# EAGLE design mbed-WiFi-Cloud-v1.0.0 (EAGLE 7.7.0)

## Sheet 1 of 4
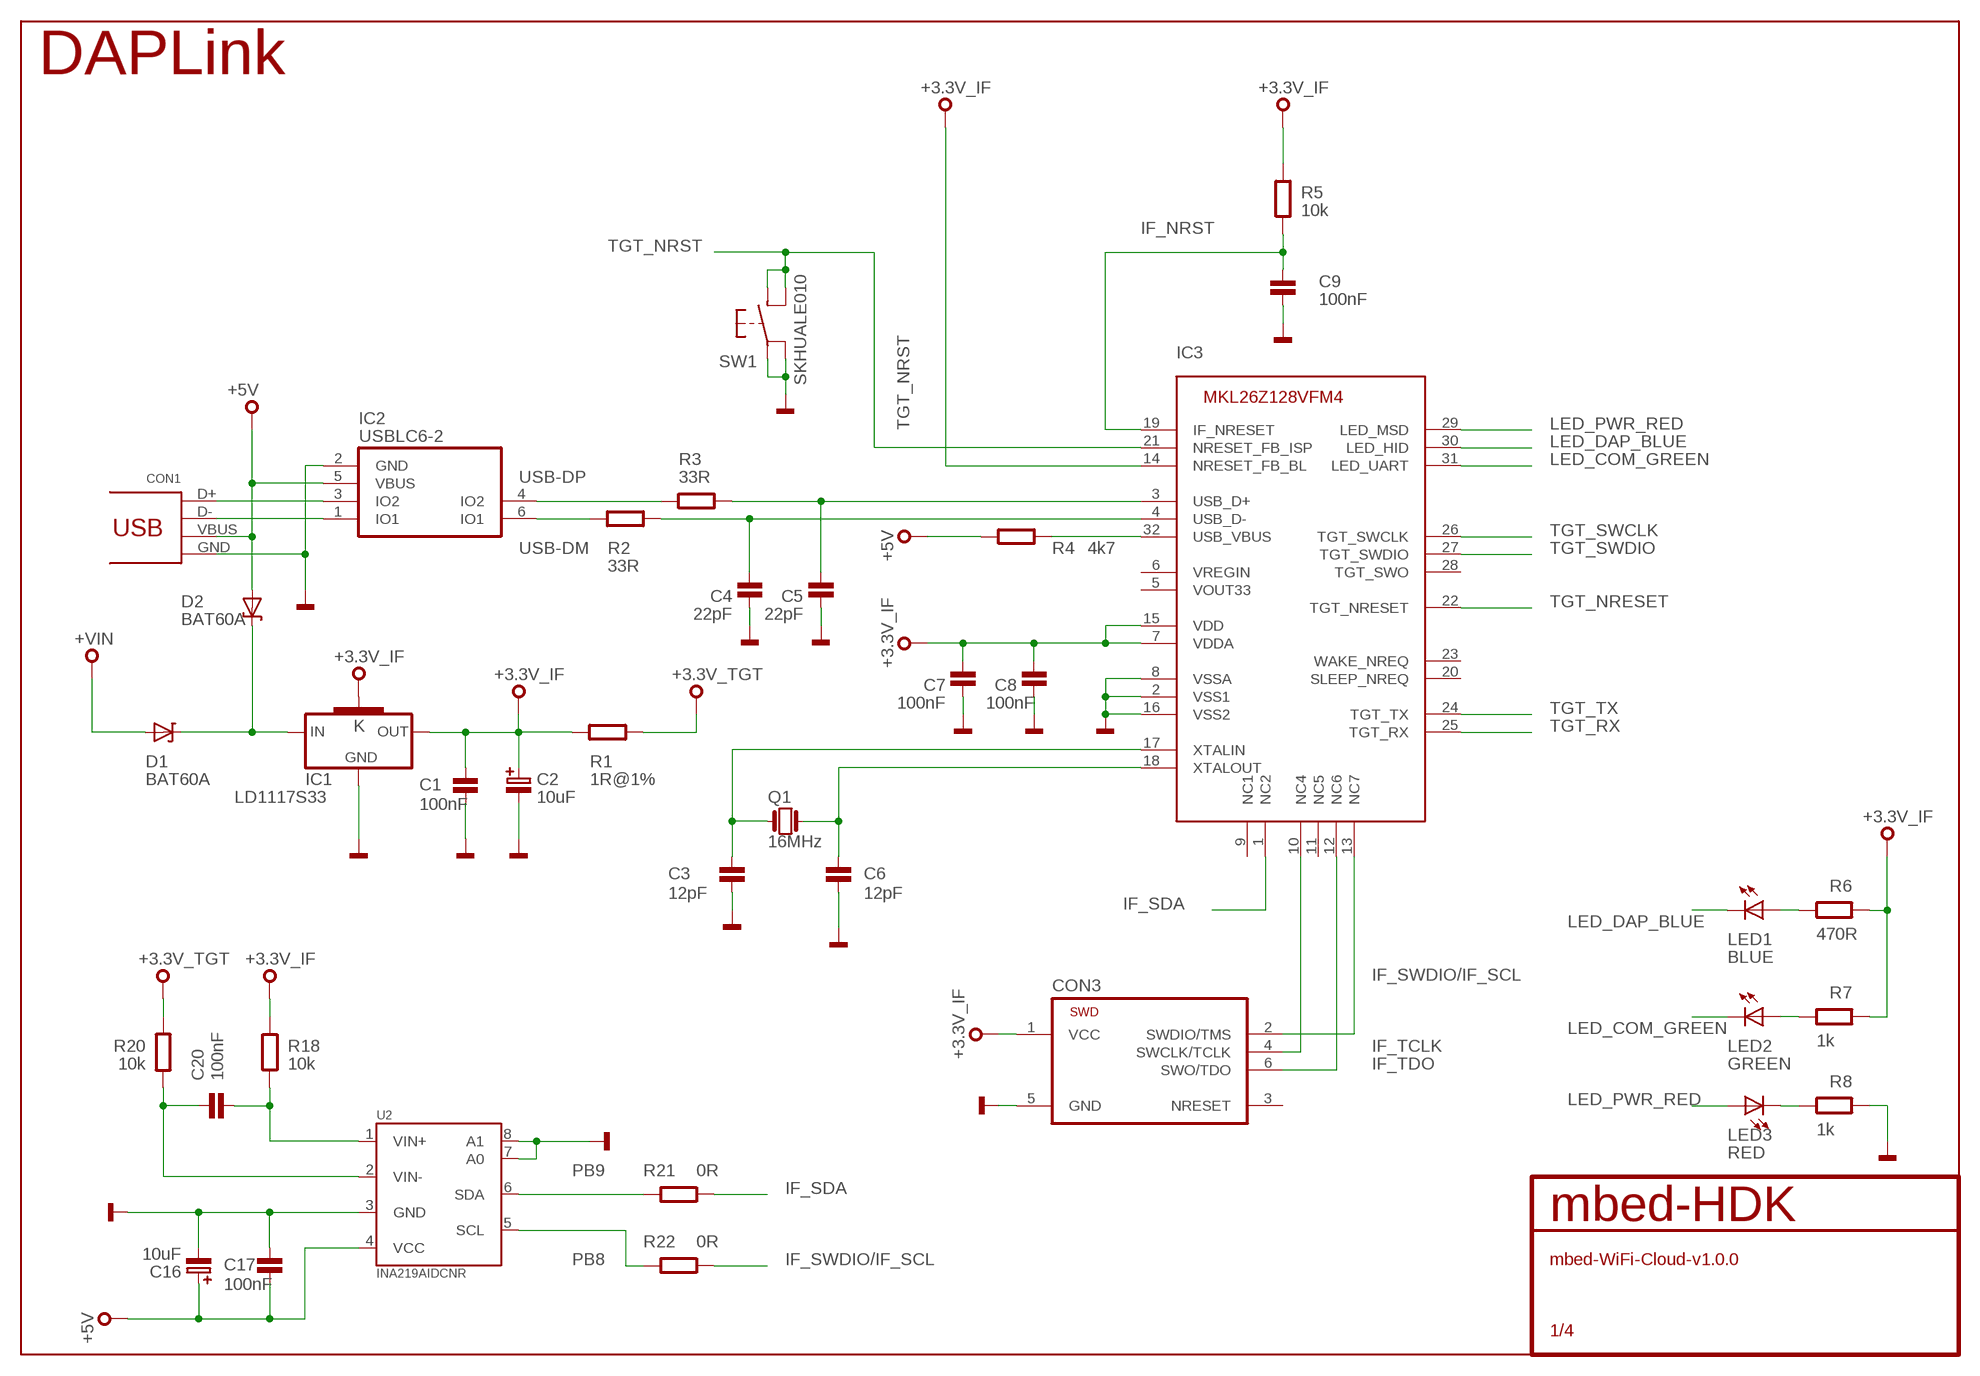
[diagram p0: schematic, sheet 1]

### Parts
C1  100nF  C0603  [0603]
C2  10uF  C-POL_B  [CASE-B]
C3  12pF  C0603  [0603]
C4  22pF  C0603  [0603]
C5  22pF  C0603  [0603]
C6  12pF  C0603  [0603]
C7  100nF  C0603  [0603]
C8  100nF  C0603  [0603]
C9  100nF  C0603  [0603]
C16  10uF  C-POL_B  [CASE-B]
C17  100nF  C0603  [0603]
C20  100nF  C0603  [0603]
CON1  USB_MICROB  [MOLEX-47364-0001]
CON3  TC2030-CTX-NL  [TC2030-CTX-NL]
D1  BAT60A  [SOD323]
D2  BAT60A  [SOD323]
IC1  LD1117S33  [SOT223]
IC2  USBLC6-2SC6  [SOT23-6L]
IC3  IF_MKL26Z128VFM4  [HVQFN32]
LED1  BLUE  LED0603  [CHIPLED_0603]
LED2  GREEN  LED0603  [CHIPLED_0603]
LED3  RED  LED0603  [CHIPLED_0603]
Q1  16MHz  Q_2.5X2.0  [2.5X2.0]
R1  1R@1%  R0603  [0603@1]
R2  33R  R0603  [0603@1]
R3  33R  R0603  [0603@1]
R4  4k7  R0603  [0603@1]
R5  10k  R0603  [0603@1]
R6  470R  R0603  [0603@1]
R7  1k  R0603  [0603@1]
R8  1k  R0603  [0603@1]
R18  10k  R0603  [0603@1]
R20  10k  R0603  [0603@1]
R21  0R  R0603  [0603@1]
R22  0R  R0603  [0603@1]
SW1  SKHUALE010  [SKHUALE010]
U2  INA219AIDCNR  [SOT23-8]

### Nets
+3.3V_IF: C1.1 C2.1 C7.2 C8.2 CON3.1(VCC) IC1.2(OUT) IC1.4(K) IC3.7(VDDA) IC3.14(NRESET_FB_BL) IC3.15(VDD) R1.2 R5.2 R6.1 R7.1 R18.2
+3.3V_TGT: R1.1 R20.2 ; also sheet 2,3,4
+5V: C16.1 C17.2 CON1.VBUS D2.A IC2.5(VBUS) R4.1 U2.4(VCC) ; also sheet 3
+VIN: D1.A ; also sheet 3
DM: CON1.D- IC2.1(IO1)
DP: CON1.D+ IC2.3(IO2)
GND: C1.2 C2.2 C3.1 C4.1 C5.1 C6.1 C7.1 C8.1 C9.1 C16.2 C17.1 CON1.GND CON3.5(GND) IC1.1(GND) IC2.2(GND) IC3.2(VSS1) IC3.8(VSSA) IC3.16(VSS2) R8.1 SW1.P$1(A1) SW1.P$2(A2) U2.3(GND) U2.7(A0) U2.8(A1) ; also sheet 2,3,4
IF_NRST: C9.2 IC3.19(IF_NRESET) R5.1
IF_SDA: IC3.1(NC2) R21.1
IF_SWDIO/IF_SCL: CON3.2(SWDIO/TMS) IC3.13(NC7) R22.1
IF_TCLK: CON3.4(SWCLK/TCLK) IC3.10(NC4)
IF_TDO: CON3.6(SWO/TDO) IC3.12(NC6)
LED_COM_GREEN: IC3.31(LED_UART) LED2.C
LED_DAP_BLUE: IC3.30(LED_HID) LED1.C
LED_PWR_RED: IC3.29(LED_MSD) LED3.A
N$1: IC3.32(USB_VBUS) R4.2
N$6: LED2.A R7.2
N$7: C4.2 IC3.4(USB_D-) R2.1
N$8: C3.2 IC3.17(XTALIN) Q1.1
N$10: D1.K D2.K IC1.3(IN)
N$12: C6.2 IC3.18(XTALOUT) Q1.3
N$13: LED1.A R6.2
N$15: C20.2 R20.1 U2.2(VIN-)
N$16: C5.2 IC3.3(USB_D+) R3.1
N$17: C20.1 R18.1 U2.1(VIN+)
N$33: LED3.C R8.2
PB8: R22.2 U2.5(SCL) ; also sheet 2,3
PB9: R21.2 U2.6(SDA) ; also sheet 2,3
TGT_NRESET: IC3.22(TGT_NRESET) ; also sheet 2,3
TGT_NRST: IC3.21(NRESET_FB_ISP) SW1.P$3(B1) SW1.P$4(B2)
TGT_RX: IC3.25(TGT_RX) ; also sheet 2
TGT_SWCLK: IC3.26(TGT_SWCLK) ; also sheet 2
TGT_SWDIO: IC3.27(TGT_SWDIO) ; also sheet 2
TGT_TX: IC3.24(TGT_TX) ; also sheet 2
USB-DM: IC2.6(IO1) R2.2
USB-DP: IC2.4(IO2) R3.2
Unconnected: CON3.3(NRESET) IC3.5(VOUT33) IC3.6(VREGIN) IC3.9(NC1) IC3.11(NC5) IC3.20(SLEEP_NREQ) IC3.23(WAKE_NREQ) IC3.28(TGT_SWO)

### Notes on the sheet
- DAPLink

## Sheet 2 of 4
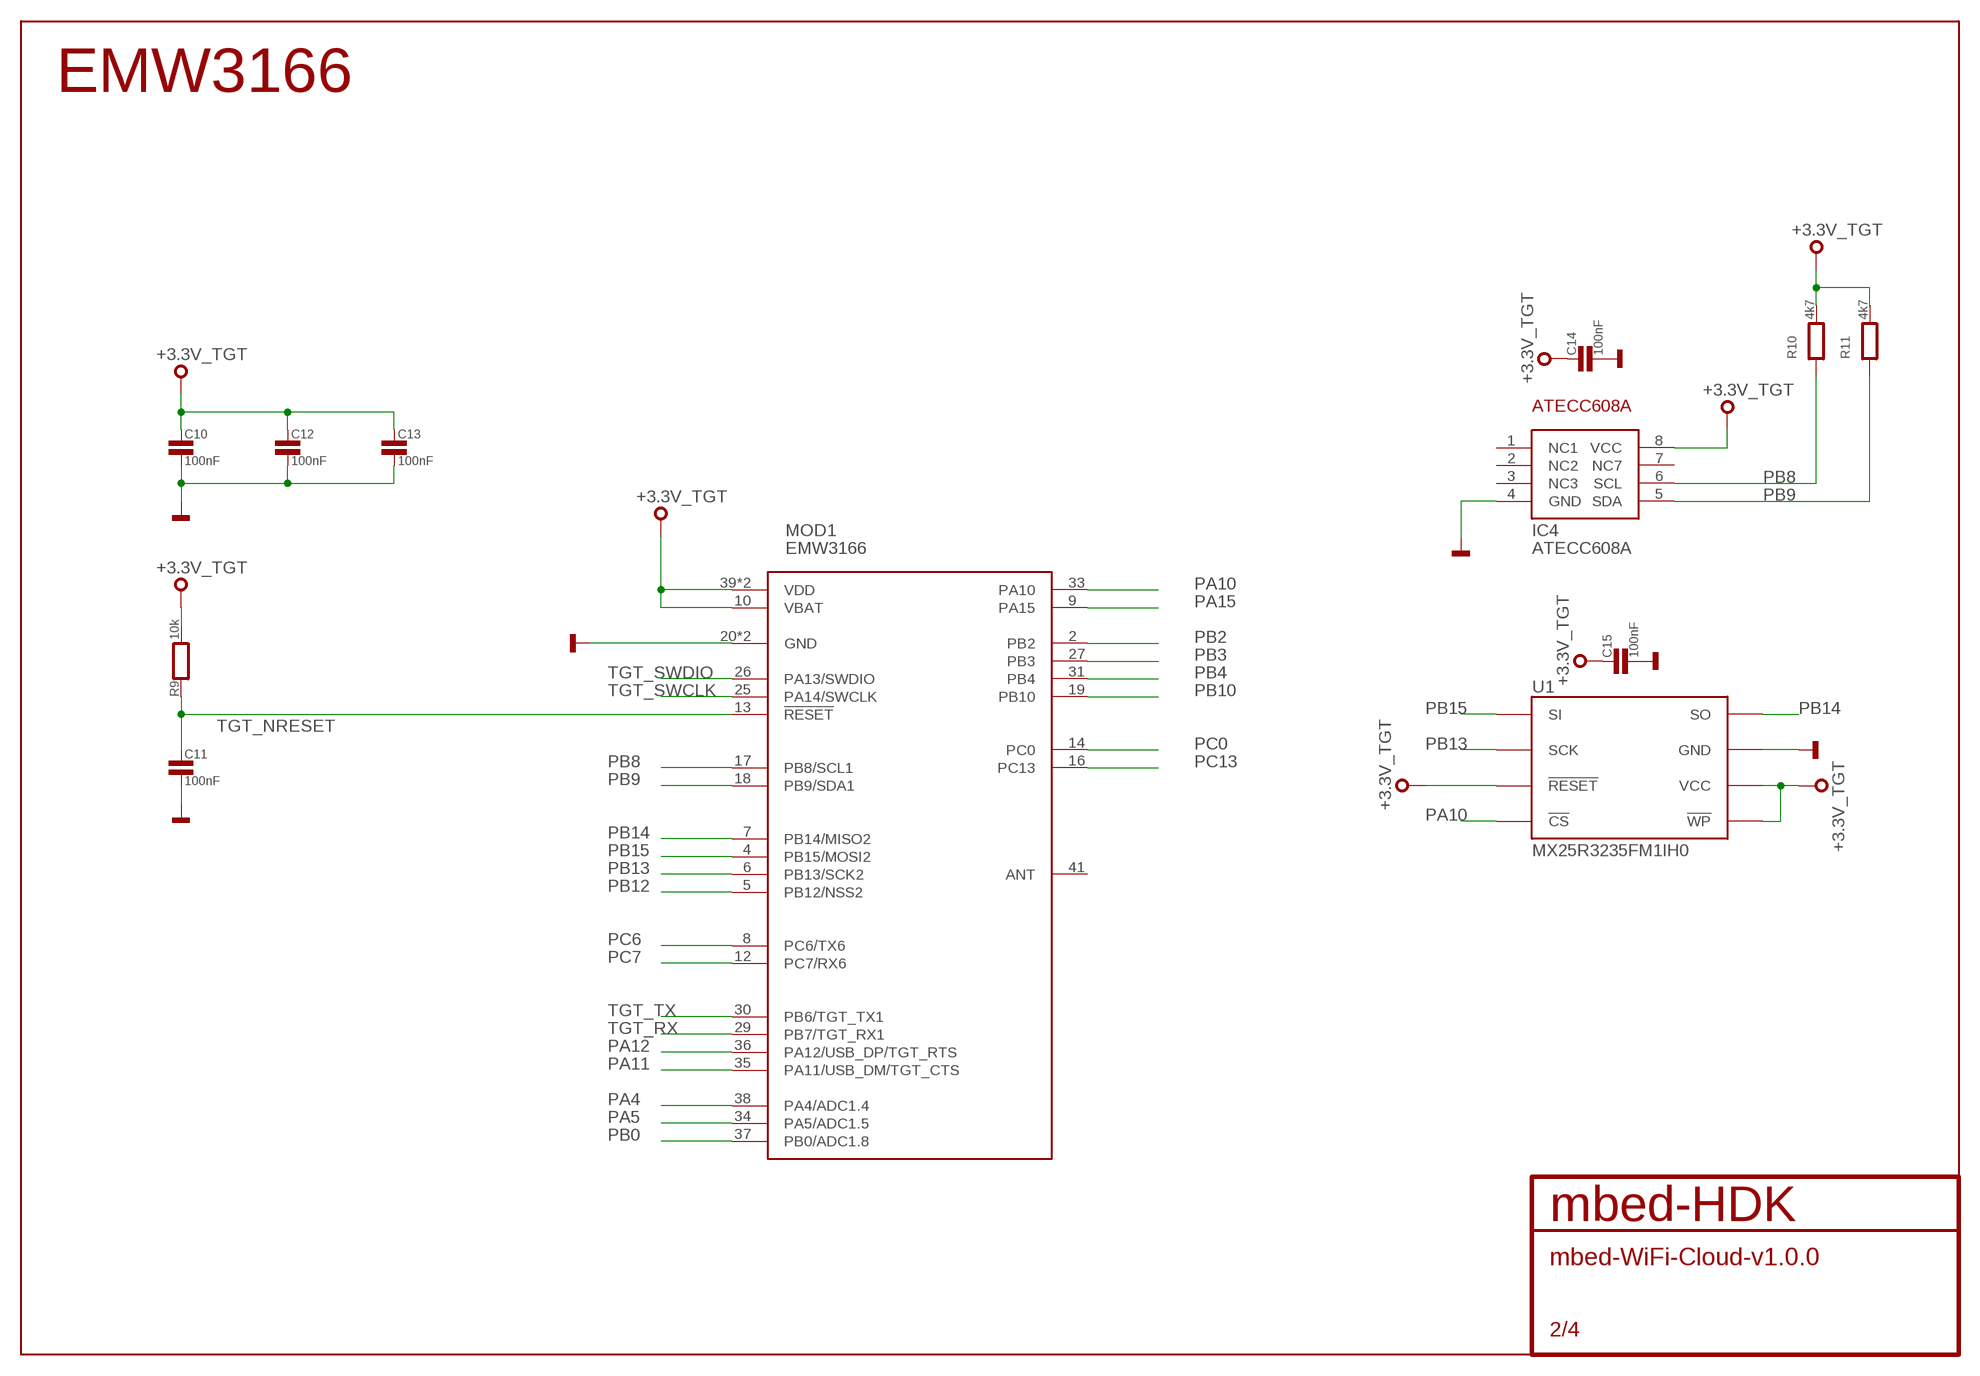
[diagram p1: schematic, sheet 2]

### Parts
C10  100nF  CAPACITOR0603  [0603]
C11  100nF  CAPACITOR0603  [0603]
C12  100nF  CAPACITOR0603  [0603]
C13  100nF  CAPACITOR0603  [0603]
C14  100nF  CAPACITOR0603  [0603]
C15  100nF  CAPACITOR0603  [0603]
IC4  ATECC608A  [SO8]
MOD1  EMW3166  [EMW3166]
R9  10k  RESISTOR0603  [0603]
R10  4k7  RESISTOR0603  [0603]
R11  4k7  RESISTOR0603  [0603]
U1  MX25R3235FM1IH0  [SO8]

### Nets
+3.3V_TGT: C10.1 C12.1 C13.1 C14.1 C15.1 IC4.8(VCC) MOD1.10(VBAT) MOD1.39(VDD) MOD1.40(VDD) R9.2 R10.2 R11.2 U1.3(!WP) U1.7(!RESET) U1.8(VCC) ; also sheet 1,3,4
GND: C10.2 C11.2 C12.2 C13.2 C14.2 C15.2 IC4.4(GND) MOD1.20(GND) MOD1.21(GND) U1.4(GND) ; also sheet 1,3,4
PA4: MOD1.38(PA4/ADC1.4) ; also sheet 3
PA5: MOD1.34(PA5/ADC1.5) ; also sheet 3
PA10: MOD1.33(PA10) U1.1(!CS)
PA11: MOD1.35(PA11/USB_DM/TGT_CTS) ; also sheet 3
PA12: MOD1.36(PA12/USB_DP/TGT_RTS) ; also sheet 3
PA15: MOD1.9(PA15) ; also sheet 3,4
PB0: MOD1.37(PB0/ADC1.8) ; also sheet 3
PB2: MOD1.2(PB2) ; also sheet 3,4
PB3: MOD1.27(PB3) ; also sheet 3,4
PB4: MOD1.31(PB4) ; also sheet 3,4
PB8: IC4.6(SCL) MOD1.17(PB8/SCL1) R10.1 ; also sheet 1,3
PB9: IC4.5(SDA) MOD1.18(PB9/SDA1) R11.1 ; also sheet 1,3
PB10: MOD1.19(PB10) ; also sheet 3,4
PB12: MOD1.5(PB12/NSS2) ; also sheet 3
PB13: MOD1.6(PB13/SCK2) U1.6(SCK) ; also sheet 3
PB14: MOD1.7(PB14/MISO2) U1.2(SO) ; also sheet 3
PB15: MOD1.4(PB15/MOSI2) U1.5(SI) ; also sheet 3
PC0: MOD1.14(PC0) ; also sheet 3
PC6: MOD1.8(PC6/TX6) ; also sheet 3
PC7: MOD1.12(PC7/RX6) ; also sheet 3
PC13: MOD1.16(PC13) ; also sheet 3
TGT_NRESET: C11.1 MOD1.13(!RESET) R9.1 ; also sheet 1,3
TGT_RX: MOD1.29(PB7/TGT_RX1) ; also sheet 1
TGT_SWCLK: MOD1.25(PA14/SWCLK) ; also sheet 1
TGT_SWDIO: MOD1.26(PA13/SWDIO) ; also sheet 1
TGT_TX: MOD1.30(PB6/TGT_TX1) ; also sheet 1
Unconnected: IC4.1(NC1) IC4.2(NC2) IC4.3(NC3) IC4.7(NC7) MOD1.41(ANT)

### Notes on the sheet
- EMW3166

## Sheet 3 of 4
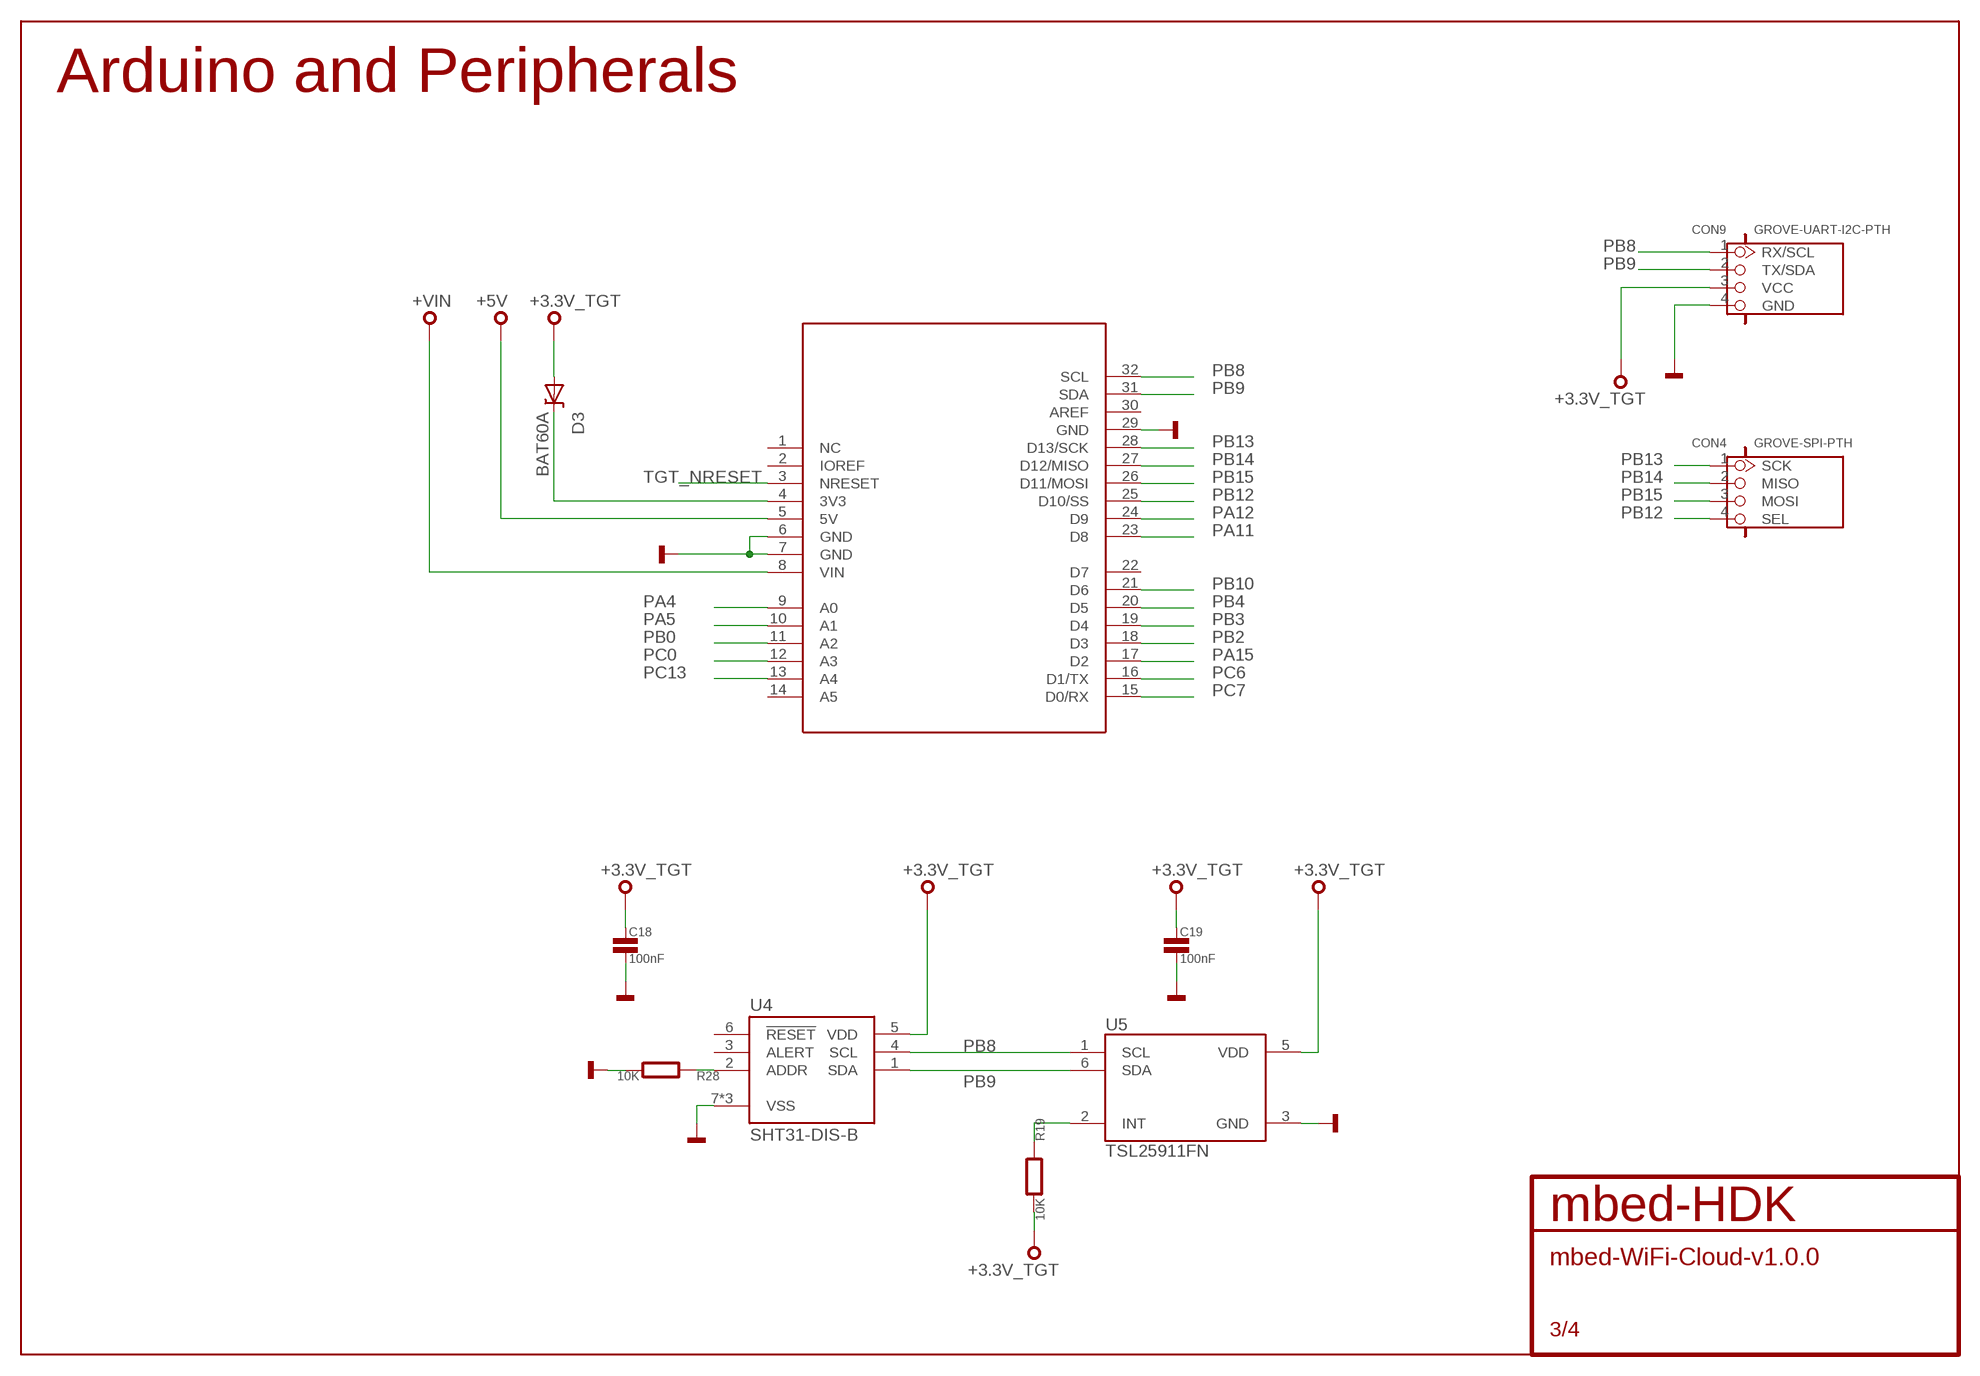
[diagram p2: schematic, sheet 3]

### Parts
BRD1  K64F/K22F-SHIELD  [K64F/K22F]
C18  100nF  CAPACITOR0603  [0603]
C19  100nF  CAPACITOR0603  [0603]
CON4  GROVE-SPI-PTH  [HW4-2.0]
CON9  GROVE-UART-I2C-PTH  [HW4-2.0]
D3  BAT60A  [SOD323]
R19  10K  RESISTOR0603  [0603]
R28  10K  RESISTOR0603  [0603]
U4  SHT31-DIS-B  [8-DFN]
U5  TSL25911FN  [6-WFDFN]

### Nets
+3.3V_TGT: C18.1 C19.1 CON9.3(VCC) D3.A R19.2 U4.5(VDD) U5.5(VDD) ; also sheet 1,2,4
+5V: BRD1.5(5V) ; also sheet 1
+VIN: BRD1.8(VIN) ; also sheet 1
GND: BRD1.6(GND) BRD1.7(GND) BRD1.29(GND) C18.2 C19.2 CON9.4(GND) R28.2 U4.7(VSS) U4.8(VSS) U4.9(VSS) U5.3(GND) ; also sheet 1,2,4
N$3: R28.1 U4.2(ADDR)
N$18: BRD1.4(3V3) D3.K
N$24: R19.1 U5.2(INT)
PA4: BRD1.9(A0) ; also sheet 2
PA5: BRD1.10(A1) ; also sheet 2
PA11: BRD1.23(D8) ; also sheet 2
PA12: BRD1.24(D9) ; also sheet 2
PA15: BRD1.17(D2) ; also sheet 2,4
PB0: BRD1.11(A2) ; also sheet 2
PB2: BRD1.18(D3) ; also sheet 2,4
PB3: BRD1.19(D4) ; also sheet 2,4
PB4: BRD1.20(D5) ; also sheet 2,4
PB8: BRD1.32(SCL) CON9.1(RX/SCL) U4.4(SCL) U5.1(SCL) ; also sheet 1,2
PB9: BRD1.31(SDA) CON9.2(TX/SDA) U4.1(SDA) U5.6(SDA) ; also sheet 1,2
PB10: BRD1.21(D6) ; also sheet 2,4
PB12: BRD1.25(D10/SS) CON4.4(SEL) ; also sheet 2
PB13: BRD1.28(D13/SCK) CON4.1(SCK) ; also sheet 2
PB14: BRD1.27(D12/MISO) CON4.2(MISO) ; also sheet 2
PB15: BRD1.26(D11/MOSI) CON4.3(MOSI) ; also sheet 2
PC0: BRD1.12(A3) ; also sheet 2
PC6: BRD1.16(D1/TX) ; also sheet 2
PC7: BRD1.15(D0/RX) ; also sheet 2
PC13: BRD1.13(A4) ; also sheet 2
TGT_NRESET: BRD1.3(NRESET) ; also sheet 1,2
Unconnected: BRD1.1(NC) BRD1.2(IOREF) BRD1.14(A5) BRD1.22(D7) BRD1.30(AREF) U4.3(ALERT) U4.6(!RESET)

### Notes on the sheet
- Arduino and Peripherals

## Sheet 4 of 4
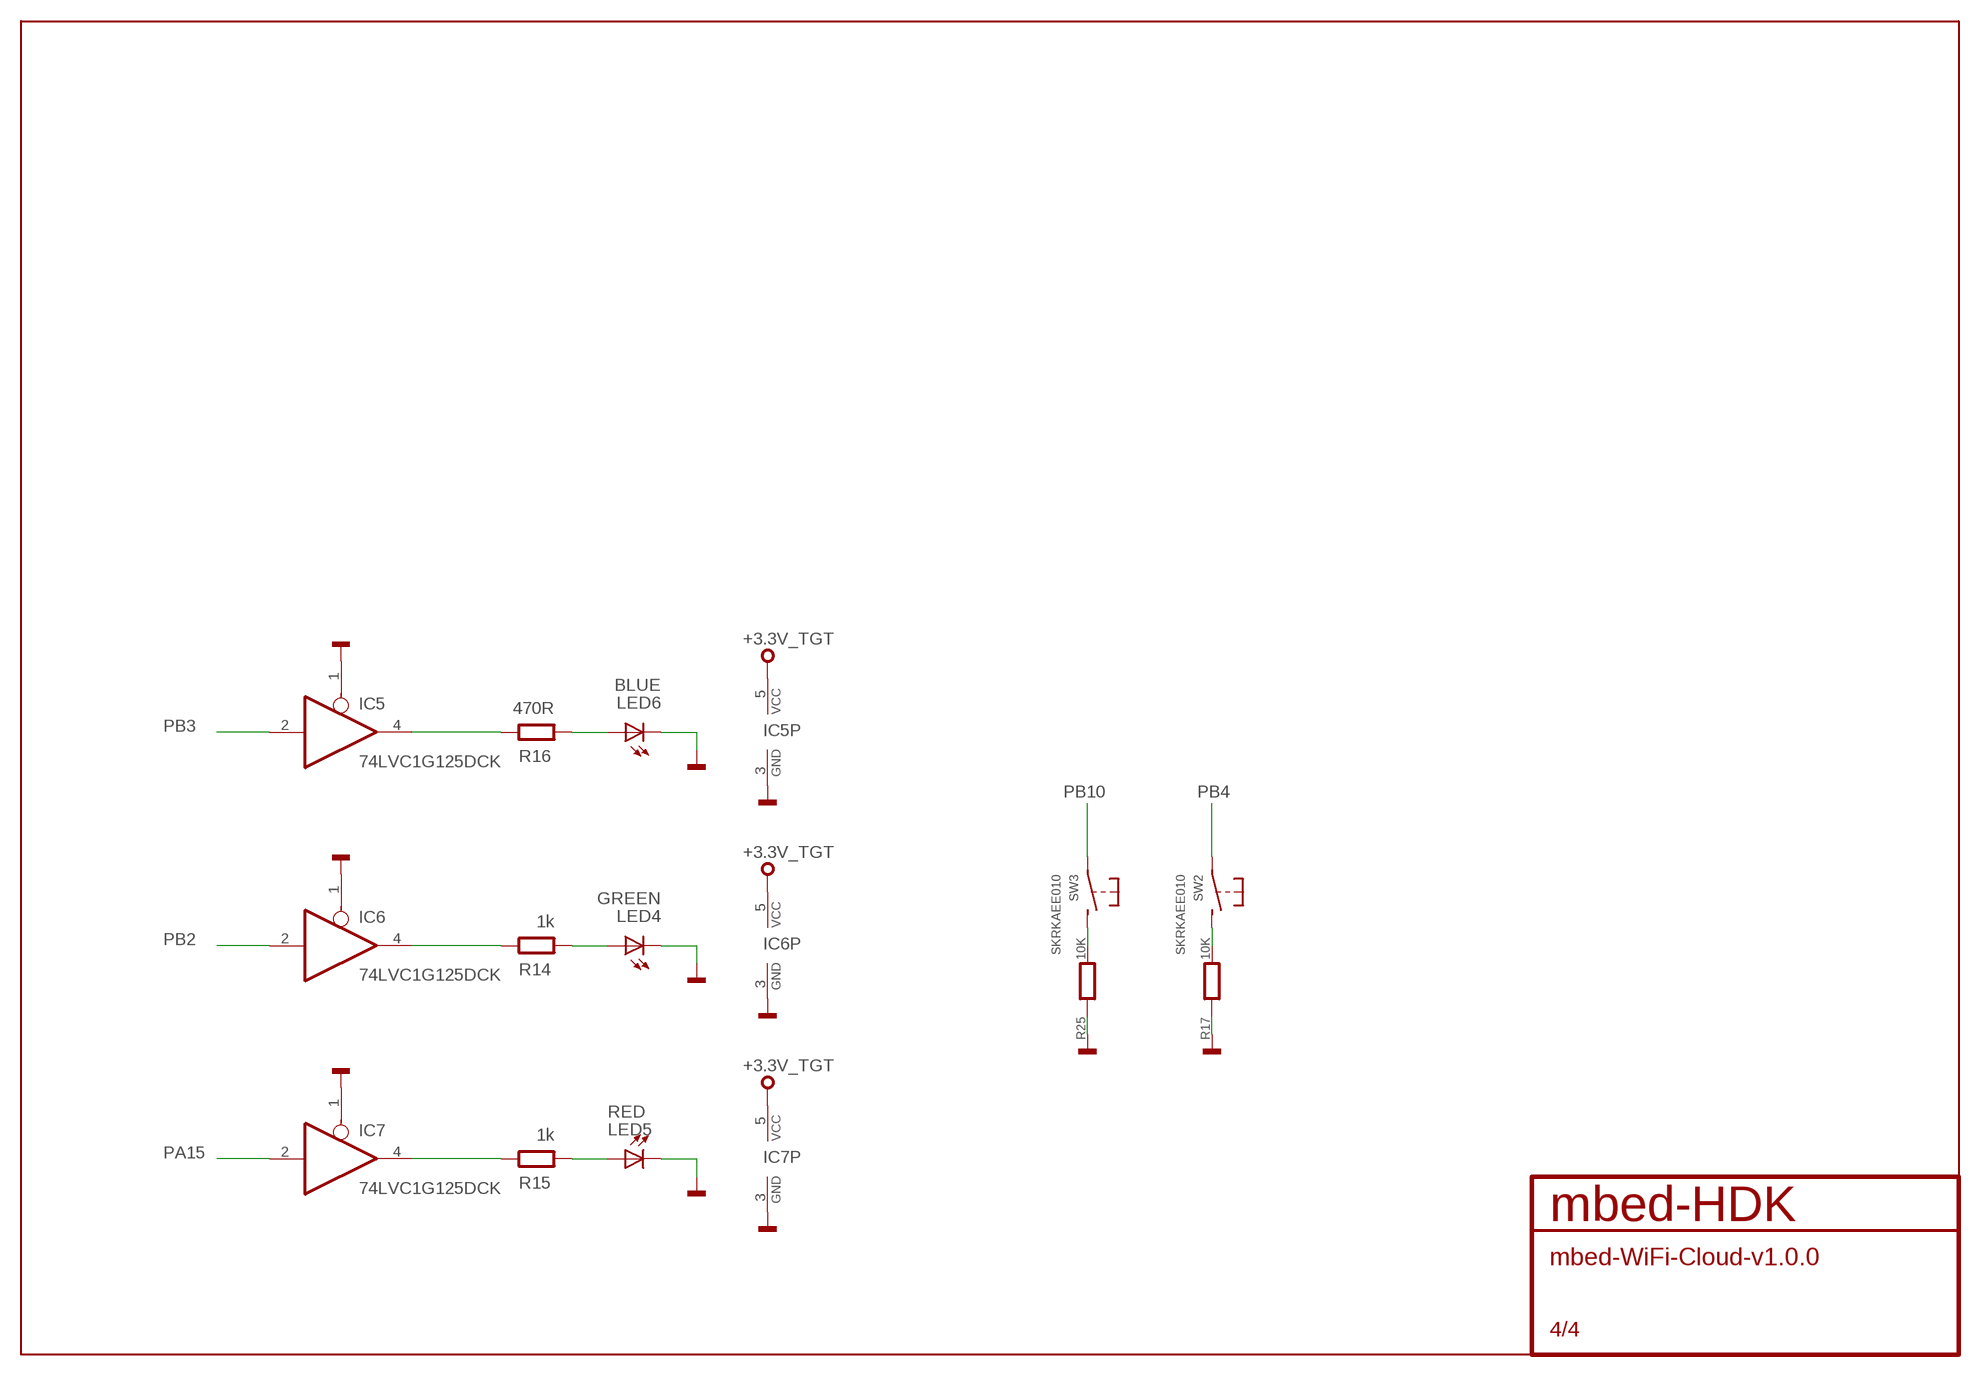
[diagram p3: schematic, sheet 4]

### Parts
IC5  74LVC1G125DCK  [SC70-5]
IC6  74LVC1G125DCK  [SC70-5]
IC7  74LVC1G125DCK  [SC70-5]
LED4  GREEN  LED0603  [CHIPLED_0603]
LED5  RED  LED0603  [CHIPLED_0603]
LED6  BLUE  LED0603  [CHIPLED_0603]
R14  1k  R0603  [0603@1]
R15  1k  R0603  [0603@1]
R16  470R  R0603  [0603@1]
R17  10K  RESISTOR0603  [0603]
R25  10K  RESISTOR0603  [0603]
SW2  SKRKAEE010  [SKRKAEE010]
SW3  SKRKAEE010  [SKRKAEE010]

### Nets
+3.3V_TGT: IC5.5(VCC) IC6.5(VCC) IC7.5(VCC) ; also sheet 1,2,3
GND: IC5.1(OE) IC5.3(GND) IC6.1(OE) IC6.3(GND) IC7.1(OE) IC7.3(GND) LED4.C LED5.C LED6.C R17.1 R25.1 ; also sheet 1,2,3
N$2: LED4.A R14.2
N$4: IC7.4(O) R15.1
N$5: LED5.A R15.2
N$9: IC6.4(O) R14.1
N$11: IC5.4(O) R16.1
N$14: LED6.A R16.2
N$22: R17.2 SW2.P$2(S)
N$23: R25.2 SW3.P$2(S)
PA15: IC7.2(I) ; also sheet 2,3
PB2: IC6.2(I) ; also sheet 2,3
PB3: IC5.2(I) ; also sheet 2,3
PB4: SW2.P$1(P) ; also sheet 2,3
PB10: SW3.P$1(P) ; also sheet 2,3

## Library data of the parts
BRD1 = mbed-HDK-misc-Board:K64F/K22F-SHIELD: Shield for K64F/K22F
C1 C3-C9 C17 C20 = mbed-HDK:C: Capacitor
C2 C16 = mbed-HDK:C-POL: Polarised capacitor
C10-C15 C18 C19 = mbed-HDK-RLC:CAPACITOR: Capacitor
CON1 = mbed-HDK:USB: USB Connectors
CON3 = mbed-HDK-Connector:TC2030-CTX: Tag-Connect In Circuit Programming & Debug Cable 6 Pin
CON4 = Treadstone:GROVE-SPI-PTH
CON9 = Treadstone:GROVE-UART-I2C-PTH
D1-D3 = mbed-HDK-Transistor:BAT60A: SCHOTTKY DIODE; MF: Infineon; MFN: BAT60AE6327HTSA1; OC-DIGIKEY: BAT60AE6327HTSA1CT-ND; OC-MOUSER: 726-BAT60AE6327; OC-NEWARK: 85X4127
IC1 = mbed-HDK:LD1117S33: VOLTAGE REGULATOR SMD 3,3V
IC2 = mbed-HDK:USBLC6-2
IC3 = mbed-HDK:IF_MKL26Z128VFM4: CMSIS-DAP Interface (MK20DX128)
IC4 = blackbriar:ATECC608A
IC5-IC7 = 74xx-little-us:74*1G125: Single Bus Buffer Gate with 3-State Output
LED1-LED6 = mbed-HDK:LED: SMD LED
MOD1 = blackbriar:EMW3166
Q1 = mbed-HDK:Q
R1-R8 R14-R16 R18 R20-R22 = mbed-HDK:R
R9-R11 R17 R19 R25 R28 = mbed-HDK-RLC:RESISTOR: Resistor
SW1 = mbed-HDK-Switch:SKHUALE010: MOMENTARY SWITCH PUSH VERTICAL (4-SPST); MF: ALPS; MFN: SKHUALE010; OC-MOUSER: 688-SKHUALE010
SW2 SW3 = mbed-HDK-Switch:SKRKAEE010: MOMENTARY SWITCH PUSH VERTICAL (SPST); MF: ALPS; MFN: SKRKAEE010; OC-MOUSER: 688-SKRKAE
U1 = blackbriar:MX25R3235FM1IH0: Serial Flash 32 Mb 80 Mhz; MF: Macronix; MFN: MX25R3235FM2IH0; OC-DIGIKEY: 1092-1174-ND
U2 = mbed-HDK-IC:INA219AIDCNR: Current Sense - I2C Bi-Directional CURRENT/POWER MONITOR with I2C Interface; MF: Texas Instruments; MFN: INA219AIDCNR; OC-DIGIKEY: 296-23770-1-ND; OC-MOUSER: 595-INA219AIDCNR; OC-NEWARK: 2295989
U4 = mbed-HDK-IC:SHT31-DIS-B: Temperature and Humidity Sensor I2C 2% 8DFN; MF: Sensirion; MFN: SHT31-DIS-B; OC-DIGIKEY: 1649-1011-1-ND; OC-MOUSER: 403-SHT31-DIS-B; OC-NEWARK: 2474218
U5 = mbed-HDK-IC:TSL25911FN: Sensor Light Digital, High Dynamic Range, 6-WFDFN; MF: ams; MFN: TSL25911FN; OC-DIGIKEY: TSL25911FNCT-ND; OC-MOUSER: 985-TSL25911FN; OC-NEWARK: 09X0688

## Board
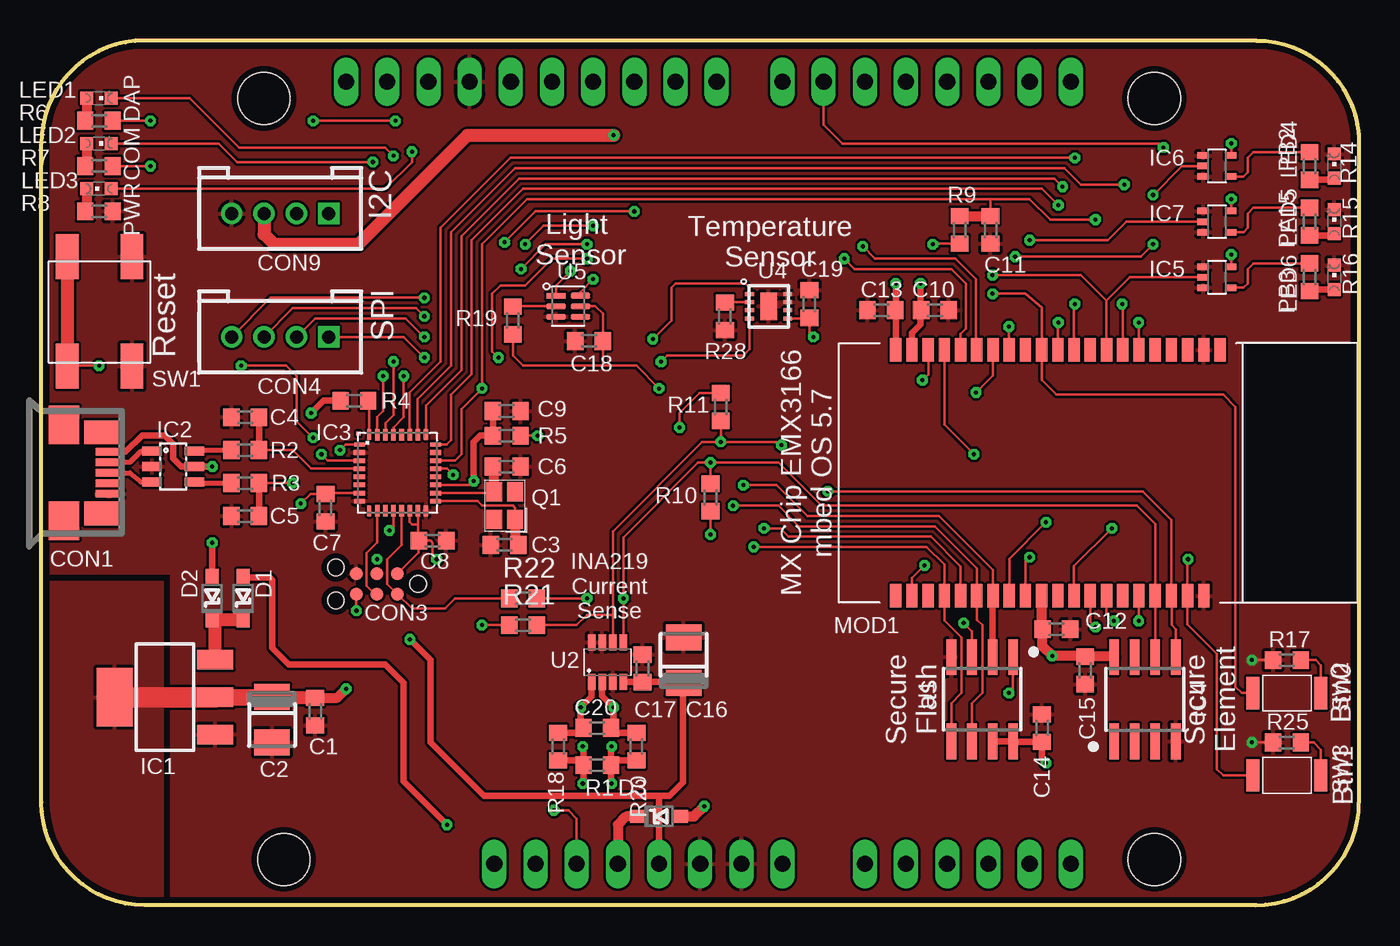
[diagram p4: board, top side]
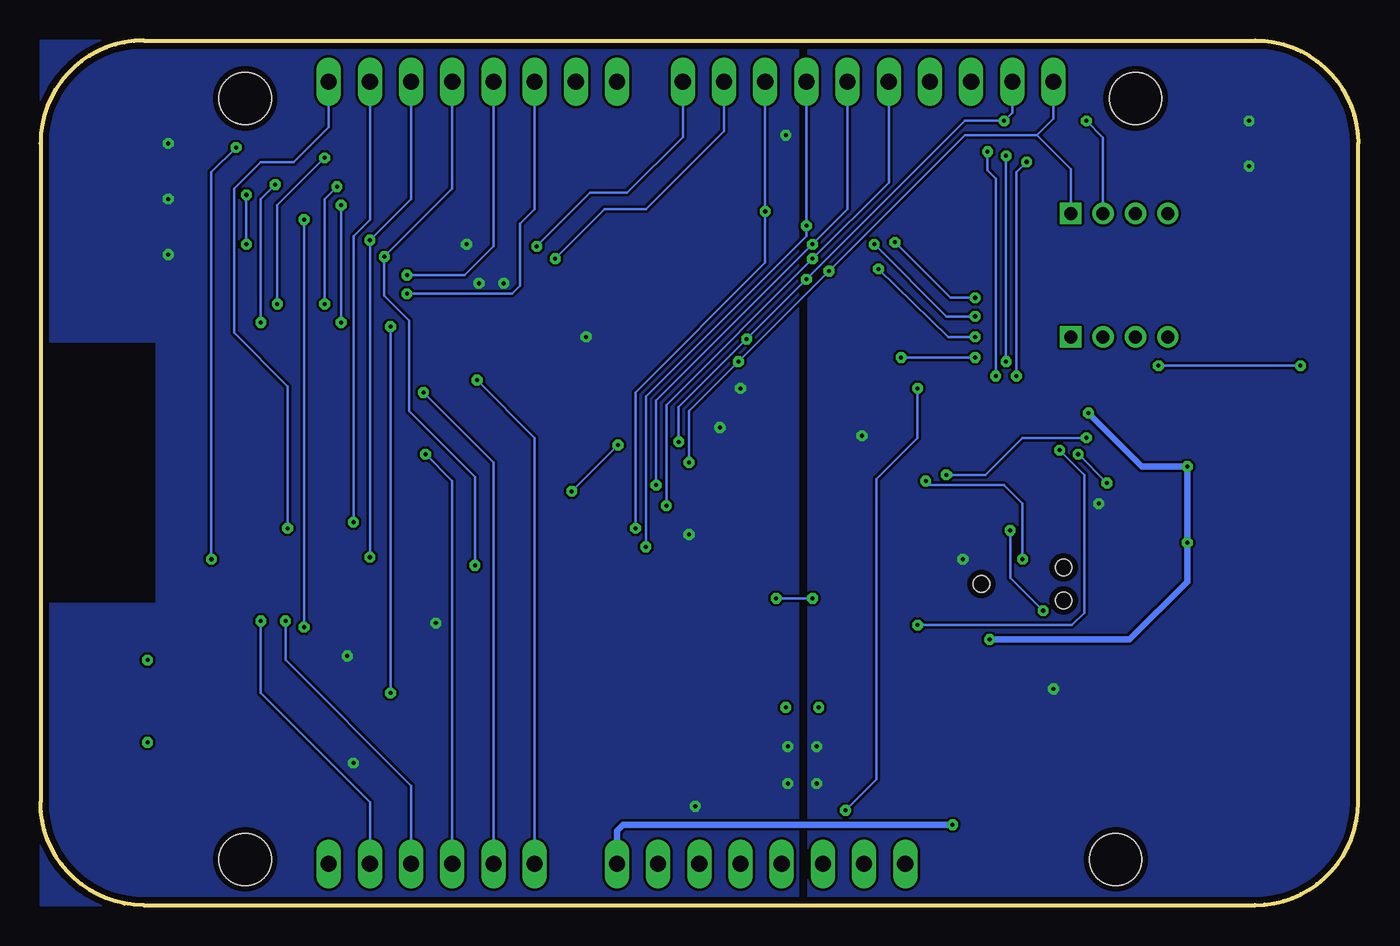
[diagram p5: board, bottom side, seen from below]

Size 81.33 x 53.34 mm. Coordinates in mm from the lower left corner, seen from the top.
Copper layers ((1*16)): Top 0.035mm / dielectric 0.8mm / Bottom 0.035mm
Design rules "mbed-HDK-6-6-2-layer *": minimum track width 6mil, minimum drill 6mil, track to track 6mil, track to pad 6mil, pad to pad 6mil, via to via 6mil, smd to smd 6mil, copper to edge 15mil, drill to drill 8mil, minimum pad ring 10mil, minimum via ring 8mil, stop-mask expansion 4mil, vias tented up to drill 0mil, thermal gap 8mil

### Footprints (pad centres in the part's own frame; a part is rotated, then mirrored left to right if it is on the bottom)
K64F/K22F = drill 1 long: 1 27.94,2.54; 2 30.48,2.54; 3 33.02,2.54; 4 35.56,2.54; 5 38.1,2.54; 6 40.64,2.54; 7 43.18,2.54; 8 45.72,2.54; 9 50.8,2.54; 10 53.34,2.54; 11 55.88,2.54; 12 58.42,2.54; 13 60.96,2.54; 14 63.5,2.54; 15 63.5,50.8; 16 60.96,50.8; 17 58.42,50.8; 18 55.88,50.8; 19 53.34,50.8; 20 50.8,50.8; 21 48.26,50.8; 22 45.72,50.8; 23 41.656,50.8; 24 39.116,50.8; 25 36.576,50.8; 26 34.036,50.8; 27 31.496,50.8; 28 28.956,50.8; 29 26.416,50.8; 30 23.876,50.8; 31 21.336,50.8; 32 18.796,50.8 | hole 3.2: 13.729,49.759; 14.948,2.819; 68.656,2.819; 68.656,49.759
0603 = smd 1 x 1.1: 1 -0.85,0; 2 0.85,0
CASE-B = smd 1.6 x 2.2: 1 -1.4,0; 2 1.4,0
MOLEX-47364-0001 = smd 1.7 x 0.45: 4 2.8,-0.65; D+ 2.8,0; D- 2.8,0.65; GND 2.8,-1.3; VBUS 2.8,1.3 | smd 1.9 x 2.375: GND1 0,2.95; GND4 0,-2.95 | smd 2.1 x 1.475: GND2 2.3,2.5; GND3 2.3,-2.5
TC2030-CTX-NL = smd 0.787 x 0.787: 1 -1.27,-0.635; 2 -1.27,0.635; 3 0,-0.635; 4 0,0.635; 5 1.27,-0.635; 6 1.27,0.635 | hole 0.991: -2.54,0; 2.54,1.016; 2.54,-1.016
HW4-2.0 = drill 0.8 pad 1.27 square: 1 -3,0 | drill 0.8 pad 1.27: 2 -1,0; 3 1,0; 4 3,0
SOD323 = smd 1 x 0.8: A 1.3,0; K -1.3,0
SOT223 = smd 1.219 x 2.235: 1 -2.311,-3.099; 2 0,-3.099; 3 2.311,-3.099 | smd 3.6 x 2.2: 4 0,3.099
SOT23-6L = smd 0.55 x 1.2: 1 -0.95,-1.3; 2 0,-1.3; 3 0.95,-1.3; 4 0.95,1.3; 5 0,1.3; 6 -0.95,1.3
HVQFN32 = smd 0.7 x 0.28: 1 -2.35,1.75; 2 -2.35,1.25; 3 -2.35,0.75; 4 -2.35,0.25; 5 -2.35,-0.25; 6 -2.35,-0.75; 7 -2.35,-1.25; 8 -2.35,-1.75; 17 2.35,-1.75; 18 2.35,-1.25; 19 2.35,-0.75; 20 2.35,-0.25; 21 2.35,0.25; 22 2.35,0.75; 23 2.35,1.25; 24 2.35,1.75 | smd 0.28 x 0.7: 9 -1.75,-2.35; 10 -1.25,-2.35; 11 -0.75,-2.35; 12 -0.25,-2.35; 13 0.25,-2.35; 14 0.75,-2.35; 15 1.25,-2.35; 16 1.75,-2.35; 25 1.75,2.35; 26 1.25,2.35; 27 0.75,2.35; 28 0.25,2.35; 29 -0.25,2.35; 30 -0.75,2.35; 31 -1.25,2.35; 32 -1.75,2.35 | smd 0.25 x 0.25: M1 -2.415,2.415
SO8 = smd 0.6 x 2.2: 1 -1.905,-2.6; 2 -0.635,-2.6; 3 0.635,-2.6; 4 1.905,-2.6; 5 1.905,2.6; 6 0.635,2.6; 7 -0.635,2.6; 8 -1.905,2.6
SC70-5 = smd 0.4 x 0.7: 1 -0.65,-0.85; 2 0,-0.85; 3 0.65,-0.85; 4 0.65,0.85; 5 -0.65,0.85
CHIPLED_0603 = smd 0.8 x 0.8: A 0,-0.75; C 0,0.75
EMW3166 = smd 0.7 x 1.45: 1 0,7.585; 2 -1,7.585; 3 -2,7.585; 4 -3,7.585; 5 -4,7.585; 6 -5,7.585; 7 -6,7.585; 8 -7,7.585; 9 -8,7.585; 10 -9,7.585; 11 -10,7.585; 12 -11,7.585; 13 -12,7.585; 14 -13,7.585; 15 -14,7.585; 16 -15,7.585; 17 -16,7.585; 18 -17,7.585; 19 -18,7.585; 20 -19,7.585; 21 -19,-7.585; 22 -18,-7.585; 23 -17,-7.585; 24 -16,-7.585; 25 -15,-7.585; 26 -14,-7.585; 27 -13,-7.585; 28 -12,-7.585; 29 -11,-7.585; 30 -10,-7.585; 31 -9,-7.585; 32 -8,-7.585; 33 -7,-7.585; 34 -6,-7.585; 35 -5,-7.585; 36 -4,-7.585; 37 -3,-7.585; 38 -2,-7.585; 39 -1,-7.585; 40 0,-7.585; 41 -20,-7.585
2.5X2.0 = smd 1.2 x 1: 1 -0.85,-0.65; 2 0.85,-0.65; 3 0.85,0.65; 4 -0.85,0.65
0603@1 = smd 1 x 1.1: 1 -0.85,0; 2 0.85,0
SKHUALE010 = smd 2.75 x 1.4: P$1 0,0; P$2 6.75,0; P$3 0,-4; P$4 6.75,-4
SKRKAEE010 = smd 0.8 x 2: P$1 -2.1,0; P$2 2.1,0
SOT23-8 = smd 1 x 0.45: 1 -1.225,0.975; 2 -1.225,0.325; 3 -1.225,-0.325; 4 -1.225,-0.975; 5 1.225,-0.975; 6 1.225,-0.325; 7 1.225,0.325; 8 1.225,0.975
8-DFN = smd 0.55 x 0.25: 1 0,1.5; 2 0,1; 3 0,0.5; 4 0,0; 5 2.35,0; 6 2.35,0.5; 7 2.35,1; 8 2.35,1.5 | smd 1 x 1.7: 9 1.175,0.75
6-WFDFN = smd 1.2 x 0.35: 1 0,0; 2 0,-0.65; 3 0,-1.3; 4 1.5,-1.3; 5 1.5,-0.65; 6 1.5,0

### Placement (x,y rotation side)
BRD1  0.05,0 0 top
C1  16.94,11.94 270 top
C2  14.28,11.43 270 top
C3  28.63,22.23 0 top
C4  12.63,30.1 0 top
C5  12.63,24 0 top
C6  28.76,27.05 180 top
C7  17.58,24.51 90 top
C8  24.18,22.48 180 top
C9  28.76,30.48 180 top
C10  55.17,36.7 0 top
C11  58.6,41.66 270 top
C12  62.66,17.02 0 top
C13  51.87,36.7 180 top
C14  61.77,10.92 90 top
C15  64.44,14.48 270 top
C16  39.68,15.11 90 top
C17  37.14,14.61 270 top
C18  33.83,34.8 180 top
C19  47.42,37.08 90 top
C20  34.34,10.92 0 top
CON1  1.45,26.67 0 top
CON3  20.75,19.81 180 top
CON4  14.79,35.05 180 top
CON9  14.79,42.67 180 top
D1  12.5,18.92 90 top
D2  10.59,18.92 90 top
D3  38.15,5.46 0 top
IC1  7.67,12.83 90 top
IC2  8.18,27.05 270 top
IC3  22.02,26.67 0 top
IC4  68.12,12.7 0 top
IC5  72.57,38.73 270 top
IC6  72.57,45.59 270 top
IC7  72.57,42.16 270 top
LED1  3.61,49.78 270 top
LED2  3.61,46.99 270 top
LED3  3.61,44.2 90 top
LED4  79.81,45.59 0 top
LED5  79.81,42.16 0 top
LED6  79.81,38.73 0 top
MOD1  52.76,26.67 180 top
Q1  28.63,24.64 90 top
R1  34.34,8.64 180 top
R2  12.63,28.07 180 top
R3  12.63,26.04 180 top
R4  19.36,31.12 0 top
R5  28.76,28.96 0 top
R6  3.61,48.39 180 top
R7  3.61,45.59 180 top
R8  3.61,42.8 180 top
R9  56.7,41.66 270 top
R10  41.33,25.15 270 top
R11  41.96,30.73 90 top
R14  78.28,45.59 270 top
R15  78.28,42.16 270 top
R16  78.28,38.73 270 top
R17  76.89,15.11 0 top
R18  31.93,9.78 270 top
R19  29.14,36.07 270 top
R20  36.76,9.78 270 top
R21  29.77,17.27 0 top
R22  29.77,18.92 0 top
R25  76.89,10.03 0 top
R28  42.22,36.32 270 top
SW1  5.64,40.01 270 top
SW2  76.89,13.08 0 top
SW3  76.89,8 0 top
U1  58.09,12.7 180 top
U2  34.98,14.99 90 top
U4  43.74,36.2 0 top
U5  31.8,37.59 0 top

### Tracks (layer width: path | path; a pad name or v marks a point on that pad's centre or on a via)
+3.3V_IF  (via drill 0.25)
  Top 0.152: IC3.14 22.77,23.63 22.91,23.5 23.29,23.5 | 23.29,23.5 23.29,24.3 IC3.15 | 23.29,23.5 23.29,22.52 C8.2 | C8.2 24.06,22.48 24.18,22.35 24.18,21.59 v24.44,21.34 | CON3.1 23.33,21.76 C8.2 | IC3.7 17.64,25.42 C7.2 16.65,25.36 v16.05,24.77 | R6.1 v6.78,48.39 | R7.1 v6.78,45.59 | R5.2 v30.66,28.96
  Top 0.406: R1.2 33.49,7.66 v33.45,7.49 | R1.2 33.49,9.74 v33.45,9.78 | R1.2 33.2,8.93 R18.2
  Top 0.61: 14.78,12.83 C2.1 | C1.1 18.3,12.79 v18.85,13.34
  Top 0.813: 14.78,12.83 16.91,12.83 C1.1
  Top 1.016: IC1.2 C2.1
  Top 1.27: IC1.2 IC1.4
  pour Bottom: 33.96,0 33.96,53.34 0.05,53.34 0.05,0
  pour Top: 7.55,0 7.55,19.94 0.05,19.94 0.05,0
+3.3V_TGT  (via drill 0.25)
  Top 0.152: U1.3 57.46,16.89 v56.95,17.4 | R9.2 55.46,40.81 v55.04,40.77 | R11.2 40.65,31.58 39.42,30.35 v39.42,29.46 | R10.2 v41.33,22.86 | U4.5 47.38,36.2 C19.1 47.42,35.31 v47.68,35.05 | IC5.5 73.46,39.42 v73.46,40.13 | IC7.5 73.46,42.85 v73.46,43.56 | IC6.5 73.46,46.28 v73.46,46.99 | U5.5 33.32,36.96 34.22,36.96 34.68,36.49 C18.1 34.68,33.31 34.72,33.27 | R19.2 29.14,33.91 29.77,33.27 34.72,33.27 | 34.72,33.27 36.76,33.27 v38.15,31.88
  Top 0.406: MOD1.39 53.76,35.29 54.28,35.81 54.28,36.66 | 54.28,36.66 C10.1 | 52.76,36.66 v52.76,38.35 | 54.28,36.66 v54.28,38.35 | MOD1.40 52.76,36.66 | 52.76,36.66 C13.1 | v62.03,8.76 61.77,9.02 C14.1 60.02,10.07 U1.8 U1.7 | R1.1 35.19,7.66 v35.23,7.49 | R1.1 35.19,9.74 v35.23,9.78 | R1.1 35.49,8.93 R20.2
  Top 0.61: MOD1.10 61.76,17.07 C12.1 61.77,16.98 61.77,16 v62.41,15.37 64.4,15.37 C15.1 66.19,15.33 IC4.8 | D3.A 40.31,5.46 v40.95,6.1
  Top 0.813: CON9.3 13.79,41.39 14.4,40.77 19.61,40.77 26.34,47.5 v35.36,47.5
  pour Bottom: 34.6,0 81.33,0 81.33,53.34 34.6,53.34
+5V  (via drill 0.25)
  Top 0.406: CON1.VBUS 5.26,27.97 6.28,28.96 7.67,28.96 8.18,28.45 8.18,27.56 8.69,27.05 IC2.5 v10.59,27.05 | R4.1 17.45,31.12 v16.69,30.35 | D2.A v10.59,22.35 | v22.79,16.38 24.06,15.11 24.06,10.03 27.36,6.73 38.15,6.73 | 38.15,6.73 BRD1.5 | U2.4 C17.2 | C17.2 | 38.15,6.73 38.79,6.73 39.63,7.58 39.63,13.76 C16.1 39.63,13.76 C17.2
  Bottom 0.406: v16.69,30.35 13.39,27.05 v10.59,27.05 v10.59,22.35 10.59,19.94 14.15,16.38 v22.79,16.38
+VIN  (via drill 0.25)
  Top 0.406: D1.A 14.12,20.22 14.28,20.07 14.28,15.88 15.29,14.86 21.26,14.86 22.41,13.72 22.41,7.62 v25.07,4.95
  Bottom 0.406: v25.07,4.95 45.39,4.95 45.77,4.57 BRD1.8
DM
  Top 0.305: CON1.D- 5.53,27.32 6.21,28 IC2.1
DP
  Top 0.305: CON1.D+ 5.51,26.67 6.21,26.1 IC2.3
GND  (via drill 0.25)
  Top 0.152: R17.1 v74.73,15.11 | R25.1 v74.73,10.03
  pour Top: 8.05,0 81.33,0 81.33,53.34 0.05,53.34 0.05,20.45 8.05,20.45
IF_NRST  (via drill 0.25)
  Top 0.152: v26.72,26.16 26.48,25.92 IC3.19
  Top 0.406: C9.2 R5.1 27.1,28.96 26.72,28.58 v26.72,26.16
  Bottom 0.152: v20.75,21.34 20.75,24.77 21.9,25.91 26.47,25.91 v26.72,26.16
IF_SDA  (via drill 0.25)
  Top 0.152: IC3.1 18.82,28.42 v18.47,28.07 | v27.23,17.27 R21.1
  Bottom 0.152: v18.47,28.07 16.94,26.54 16.94,18.03 17.71,17.27 v27.23,17.27
IF_SWDIO/IF_SCL
  Top 0.152: IC3.13 22.27,22.22 21.39,21.34 21.39,19.81 CON3.2 22.91,18.29 24.95,18.29 25.58,18.92 R22.1
IF_TCLK
  Top 0.152: CON3.4 20.63,19.18 20.12,19.69 20.12,21.72 20.77,22.37 IC3.10
IF_TDO  (via drill 0.25)
  Top 0.152: IC3.12 21.77,23.37 v21.52,23.11 | v19.48,18.16 CON3.6
  Bottom 0.152: v21.52,23.11 21.52,20.19 v19.48,18.16
LED_COM_GREEN  (via drill 0.25)
  Top 0.152: IC3.31 20.77,30.12 21.14,30.48 v21.14,32.64 | LED2.C 10.98,46.99 12.12,45.85 v20.5,45.85
  Bottom 0.152: v21.14,32.64 21.14,45.21 v20.5,45.85
LED_DAP_BLUE  (via drill 0.25)
  Top 0.152: IC3.30 21.27,29.73 21.77,30.23 v21.77,33.53 | LED1.C 9.2,49.78 12.25,46.74 21.26,46.74 v21.77,46.23
  Bottom 0.152: v21.77,33.53 v21.77,46.23
LED_PWR_RED  (via drill 0.25)
  Top 0.152: v22.41,32.64 22.41,30.1 21.77,29.47 IC3.29 | LED3.A 21.26,44.2 22.91,45.85 v22.91,46.48
  Bottom 0.152: v22.41,32.64 22.41,44.83 22.91,45.34 v22.91,46.48
N$1
  Top 0.152: IC3.32 20.27,31.05 R4.2
N$2
  Top 0.406: R14.2 79.71,44.74 LED4.A
N$3
  Top 0.152: U4.2 42.24,37.2 R28.1
N$4
  Top 0.152: IC7.4 73.44,41.53 74.22,41.53 74.47,41.78 74.47,42.67 74.82,43.01 R15.1
N$5
  Top 0.406: R15.2 79.71,41.31 LED5.A
N$6
  Top 0.61: LED2.A 2.86,45.69 R7.2
N$7
  Top 0.152: R2.1 15.55,28.07 16.69,26.92 IC3.4
  Top 0.406: R2.1 C4.2
N$8
  Top 0.152: IC3.17 26.95,24.92 27.23,24.64 29.14,24.64 29.26,24.51 29.26,23.8 Q1.1
  Top 0.61: Q1.1 29.28,22.17 C3.2
N$9
  Top 0.152: IC6.4 74.21,44.94 74.47,45.21 74.47,46.1 74.82,46.44 R14.1
N$10
  Top 0.813: IC1.3 10.77,17.19 D2.K D1.K
N$11
  Top 0.152: IC5.4 74.21,38.09 74.47,38.35 74.47,39.24 74.82,39.59 R16.1
N$12
  Top 0.152: IC3.18 27.91,25.42 Q1.3
  Top 0.61: Q1.3 27.98,26.98 C6.2
N$13
  Top 0.61: LED1.A 2.86,48.49 R6.2
N$14
  Top 0.406: R16.2 78.38,37.98 LED6.A
N$15  (via drill 0.25)
  Top 0.406: U2.2 34.65,12.9 v35.36,12.19 35.36,11.09 C20.2 35.49,10.63 R20.1
N$16  (via drill 0.25)
  Top 0.152: R3.1 v15.55,26.04 | v17.32,27.81 17.71,27.43 19.66,27.43 IC3.3
  Top 0.406: R3.1 C5.2
  Bottom 0.152: v15.55,26.04 v17.32,27.81
N$17  (via drill 0.25)
  Top 0.406: U2.1 34,12.87 v33.33,12.19 33.33,11.09 C20.1 33.2,10.63 R18.1
N$18
  Top 0.61: D3.K 36.12,5.46 35.61,4.95 BRD1.4
N$22
  Top 0.152: R17.2 78.67,15.11 78.99,14.79 SW2.P$2
N$23
  Top 0.152: R25.2 78.54,10.03 78.99,9.58 SW3.P$2
N$24
  Top 0.152: U5.2 29.16,36.94 R19.1
N$33
  Top 0.61: LED3.C 2.86,42.9 R8.2
PA4  (via drill 0.25)
  Top 0.152: MOD1.38 54.76,32.73 v54.41,32.39
  Bottom 0.152: v54.41,32.39 50.85,28.83 BRD1.9
PA5  (via drill 0.25)
  Top 0.152: MOD1.34 58.76,32.67 v57.71,31.62
  Bottom 0.152: v57.71,31.62 53.39,27.31 BRD1.10
PA10  (via drill 0.25)
  Top 0.152: U1.1 60,13.34 v59.74,13.08 | v59.74,35.69 59.74,34.27 MOD1.33
  Bottom 0.152: v59.74,13.08 v59.74,35.69
PA11  (via drill 0.25)
  Top 0.152: MOD1.35 57.71,34.3 57.71,38.61 56.44,39.88 51.49,39.88 v50.73,40.64
  Bottom 0.152: v50.73,40.64 47.42,43.94 45.14,43.94 41.71,47.37 BRD1.23
PA12  (via drill 0.25)
  Top 0.152: MOD1.36 56.76,35.24 57.08,35.56 57.08,38.35 56.19,39.24 50.22,39.24 v49.58,39.88
  Bottom 0.152: v49.58,39.88 46.53,42.93 43.99,42.93 39.17,47.75 BRD1.24
PA15  (via drill 0.25)
  Top 0.152: MOD1.9 60.76,21.21 v61.01,21.46 | v61.01,41.02 65.84,41.02 66.98,42.16 IC7.2
  Bottom 0.152: v61.01,21.46 v61.01,41.02 58.47,43.56 BRD1.17
PB0  (via drill 0.25)
  Top 0.152: MOD1.37 55.76,29.64 v57.58,27.81
  Bottom 0.152: v57.58,27.81 55.93,26.16 BRD1.11
PB2  (via drill 0.25)
  Top 0.152: MOD1.2 53.76,20.18 v54.54,20.96 | v60.12,40.01 67.87,40.01 v68.63,40.77 | v68.63,43.81 70.41,45.59 IC6.2
  Bottom 0.152: BRD1.18 55.93,44.2 v60.12,40.01 60.12,37.59 58.6,36.07 58.6,30.48 54.54,26.42 v54.54,20.96 | v68.63,40.77 v68.63,43.81
PB3  (via drill 0.25)
  Top 0.152: MOD1.27 65.76,37.29 | 65.76,37.29 64.19,38.86 v58.73,38.86 | 65.76,37.29 67.2,38.73 IC5.2
  Bottom 0.152: BRD1.19 53.39,40.64 55.17,38.86 v58.73,38.86
PB4  (via drill 0.25)
  Top 0.152: v58.73,37.72 60.76,37.72 61.76,36.85 MOD1.31 61.76,32.4 62.66,31.5 72.95,31.5 73.71,30.73 73.71,13.46 74.09,13.08 SW2.P$1
  Bottom 0.152: BRD1.20 50.85,42.93 51.74,42.04 51.74,38.23 52.25,37.72 v58.73,37.72
PB8  (via drill 0.25)
  Top 0.152: IC4.6 MOD1.17 68.76,23.5 67.62,24.64 48.19,24.64 45.52,27.31 v41.33,27.31 | v41.33,27.31 R10.1 | U4.4 43.74,34.29 43.36,33.91 38.66,33.91 v38.28,33.53 | U5.1 31.8,38.23 v32.69,39.12 | U2.5 v35.95,18.92 35.95,19.05 35.95,22.69 40.57,27.31 v41.33,27.31 | R22.2 v33.71,18.92
  Bottom 0.152: BRD1.32 18.85,48.51 19.87,47.5 | 19.87,47.5 24.31,47.5 v32.69,39.12 v38.28,33.53 41.33,30.48 v41.33,27.31 | CON9.1 17.79,45.42 19.87,47.5 | v33.71,18.92 v35.95,18.92
PB9  (via drill 0.25)
  Top 0.152: IC4.5 70.03,17.02 69.78,17.27 69.78,19.07 MOD1.18 69.76,23.77 68,25.53 v48.57,25.53 | 45.39,28.58 v45.71,28.38 45.38,28.58 v41.96,28.58 | v41.96,28.58 R11.1 | U4.1 43.74,38.1 43.49,38.35 39.17,38.35 38.91,38.1 38.91,36.07 v37.77,34.93 | U5.6 33.3,37.82 v34.09,38.61 | v16.82,48.39 v21.9,48.39 | U2.6 35.3,17.91 | 35.3,17.91 35.3,23.06 40.82,28.58 v41.96,28.58 | R21.2 33.07,17.27 33.71,17.91 35.3,17.91
  Bottom 0.152: v48.57,25.53 v45.71,28.38 | BRD1.31 21.39,48.9 v21.9,48.39 24.31,48.39 v34.09,38.61 v37.77,34.93 41.96,30.73 v41.96,28.58 | CON9.2 15.79,47.36 v16.82,48.39
PB10  (via drill 0.25)
  Top 0.152: v70.79,21.34 70.76,21.3 MOD1.19 70.76,17.31 72.57,15.49 72.57,8.38 72.95,8 SW3.P$1 | v69.27,46.74 69.01,46.99 49.46,46.99 48.31,48.13 BRD1.21
  Bottom 0.152: v70.79,21.34 70.79,45.21 v69.27,46.74
PB12  (via drill 0.25)
  Top 0.152: MOD1.5 56.76,20.89 54.92,22.73 46.15,22.73 45.65,23.24 v44.63,23.24 | CON4.4 14.2,37.47 v23.68,37.47 | v28.63,40.89 30.53,42.8 v36.63,42.8
  Bottom 0.152: BRD1.25 v36.63,42.8 36.63,39.62 44.63,31.62 v44.63,23.24 | v23.68,37.47 25.2,37.47 v28.63,40.89
PB13  (via drill 0.25)
  Top 0.152: U1.6 57.46,12.45 58.09,13.08 58.09,17.27 57.76,17.61 MOD1.6 57.76,20.78 55.17,23.37 46.79,23.37 45.52,24.64 v42.72,24.64 | CON4.1 22.41,35.05 v23.68,33.78 | v33.71,39.88 31.55,39.88 29.9,38.23 28.37,38.23 27.87,37.72 27.87,34.16 v28.25,33.78
  Bottom 0.152: BRD1.28 29.01,44.58 v33.71,39.88 42.72,30.86 v42.72,24.64 | v23.68,33.78 v28.25,33.78
PB14  (via drill 0.25)
  Top 0.152: MOD1.7 58.76,20.67 55.42,24 47.3,24 45.39,25.91 v43.36,25.91 | CON4.2 16.93,36.2 22.53,36.2 v23.68,35.05 | v29.64,39.24 31.17,40.77 v33.71,40.77
  Top 0.406: U1.2 58.73,19.05 MOD1.7
  Bottom 0.152: BRD1.27 31.55,42.93 v33.71,40.77 43.36,31.12 v43.36,25.91 | v23.68,35.05 25.33,35.05 v29.64,39.24
PB15  (via drill 0.25)
  Top 0.152: U1.5 56.19,12.45 56.82,13.08 56.82,16.51 55.76,17.57 MOD1.4 55.76,21 54.66,22.1 v43.99,22.1 | CON4.3 15.56,36.83 23.17,36.83 v23.68,36.32 | v29.9,40.77 31.04,41.91 v34.09,41.91
  Bottom 0.152: BRD1.26 v34.09,41.91 34.09,41.28 43.99,31.37 v43.99,22.1 | v23.68,36.32 25.45,36.32 v29.9,40.77
PC0  (via drill 0.25)
  Top 0.152: MOD1.14 65.76,17.99 v66.22,17.53
  Bottom 0.152: v66.22,17.53 66.22,15.11 58.47,7.37 BRD1.12
PC6  (via drill 0.25)
  Top 0.152: MOD1.8 59.76,21.35 v62.03,23.62
  Bottom 0.152: v62.03,23.62 62.03,41.28 61.01,42.29 BRD1.16
PC7  (via drill 0.25)
  Top 0.152: MOD1.12 63.76,20.91 v66.09,23.24
  Bottom 0.152: v66.09,23.24 66.09,32 69.39,35.31 69.39,44.2 67.74,45.85 65.71,45.85 63.55,48.01 BRD1.15
PC13  (via drill 0.25)
  Top 0.152: MOD1.16 67.76,17.54 v67.74,17.53
  Bottom 0.152: v67.74,17.53 67.74,13.08 61.01,6.35 BRD1.13
TGT_NRESET  (via drill 0.25)
  Top 0.152: IC3.22 25.57,27.42 25.96,27.81 25.96,30.61 v27.23,31.88 27.23,40.77 30.03,43.56 58.6,43.56 | C11.1 58.6,43.56 | MOD1.13 64.76,17.46 v65.08,17.15 | v65.08,42.29 62.28,42.29 61.01,43.56 58.6,43.56 | v31.68,5.84 32.56,5.84 33.07,5.33 BRD1.3
  Top 0.61: R9.1 C11.1
  Bottom 0.152: v65.08,17.15 v65.08,42.29 | v27.23,31.88 27.23,28.83 29.77,26.29 29.77,7.75 v31.68,5.84
TGT_NRST  (via drill 0.25)
  Top 0.152: IC3.21 25.08,26.92 v25.45,26.54 | v3.61,33.27 1.66,33.27 SW1.P$4 | v16.82,28.83 15.8,29.85 15.8,32.64 15.17,33.27 v12.37,33.27
  Top 0.813: SW1.P$3 SW1.P$4
  Bottom 0.152: v25.45,26.54 23.04,26.54 20.75,28.83 v16.82,28.83 | v12.37,33.27 v3.61,33.27
TGT_RX  (via drill 0.25)
  Top 0.152: IC3.25 23.77,30.83 25.96,33.02 25.96,41.28 29.52,44.83 62.54,44.83 v63.04,44.32 | MOD1.29 63.76,37.04 v63.81,37.08
  Bottom 0.152: v63.81,37.08 63.81,43.56 v63.04,44.32
TGT_SWCLK  (via drill 0.25)
  Top 0.152: IC3.26 23.27,31.22 25.33,33.27 25.33,41.53 29.26,45.47 63.17,45.47 64.19,44.45 v66.86,44.45 | MOD1.25 67.76,35.93 v67.74,35.94
  Bottom 0.152: v67.74,35.94 67.74,43.56 v66.86,44.45
TGT_SWDIO  (via drill 0.25)
  Top 0.152: v63.81,46.1 29.01,46.1 24.69,41.78 24.69,33.53 22.77,31.61 IC3.27 | MOD1.26 66.76,37.05 v66.73,37.08
  Bottom 0.152: v66.73,37.08 66.73,43.18 v63.81,46.1
TGT_TX  (via drill 0.25)
  Top 0.152: IC3.24 25.04,28.42 25.33,28.7 25.33,31.5 26.6,32.77 26.6,41.02 29.77,44.2 61.77,44.2 v62.79,43.18 | MOD1.30 62.76,35.91 v62.79,35.94
  Bottom 0.152: v62.79,35.94 v62.79,43.18
USB-DM
  Top 0.305: IC2.6 9.55,28.07 R2.2
USB-DP
  Top 0.305: IC2.4 9.55,26.04 R3.2

### Text on the board
TopSilkscreen: DAP | COM | PB2 | PWR | I2C | Light / Sensor | Temperature / Sensor | PA15 | PB3 | SPI | Reset | MX Chip EMX3166 / mbed OS 5.7 | INA219 / Current / Sense | Secure / Flash | Secure / Element | Btn0 | Btn1